# EAGLE design relay interface v2 (EAGLE 7.1.0)
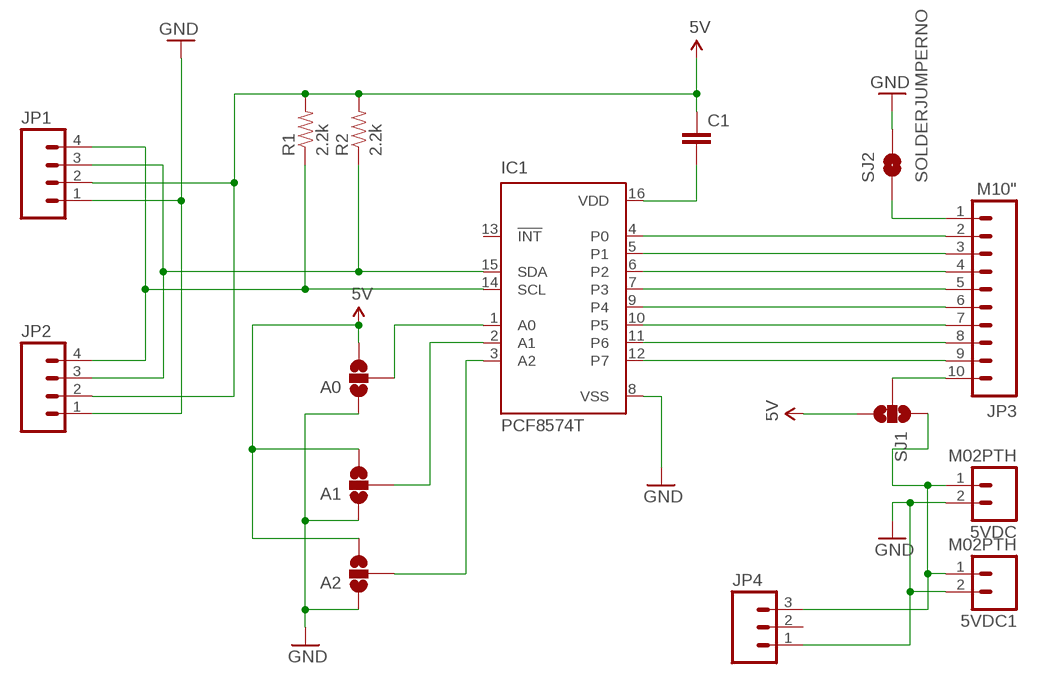
[diagram p0: schematic, sheet 1]

## Parts
5VDC  M02PTH  [1X02]
5VDC1  M02PTH  [1X02]
A0  SOLDERJUMPER_2WAYS  [SJ_3]
A1  SOLDERJUMPER_2WAYS  [SJ_3]
A2  SOLDERJUMPER_2WAYS  [SJ_3]
C1  CAPPTH2  [CAP-PTH-SMALL2]
IC1  PCF8574T  [SO16W]
JP1  M04PTH  [1X04]
JP2  M04PTH  [1X04]
JP3  M10"  [1X10]
JP4  M03PTH  [1X03]
R1  2.2k  RESISTOR1206  [1206]
R2  2.2k  RESISTOR1206  [1206]
SJ1  SOLDERJUMPER_2WAYS  [SJ_3]
SJ2  SOLDERJUMPERNO  [SJ_2S-NO]

## Nets
5V: A0.3 A1.3 A2.3 C1.1 JP1.2 JP2.2 R1.2 R2.2 SJ1.3
GND: 5VDC1.2 5VDC.2 A0.1 A1.1 A2.1 IC1.8(VSS) JP1.1 JP2.1 JP4.1 SJ2.2
N$1: IC1.4(P0) JP3.2
N$2: IC1.5(P1) JP3.3
N$3: IC1.6(P2) JP3.4
N$4: A0.2 IC1.1(A0)
N$5: IC1.14(SCL) JP1.4 JP2.4 R1.1
N$6: IC1.15(SDA) JP1.3 JP2.3 R2.1
N$7: A1.2 IC1.2(A1)
N$8: C1.2 IC1.16(VDD)
N$9: A2.2 IC1.3(A2)
N$10: IC1.7(P3) JP3.5
N$11: IC1.9(P4) JP3.6
N$12: IC1.10(P5) JP3.7
N$13: IC1.11(P6) JP3.8
N$14: IC1.12(P7) JP3.9
N$15: 5VDC1.1 5VDC.1 JP4.3 SJ1.1
N$16: JP3.1 SJ2.1
N$17: JP3.10 SJ1.2
Unconnected: IC1.13(!INT) JP4.2

## Library data of the parts
5VDC 5VDC1 = SparkFun-Connectors:M02: Standard 2-pin 0.1" header. Use with - straight break away headers ( PRT-00116) - right angle break away headers (PRT-00553) - swiss pins (PRT-00743) - machine pins (PRT-00117) - female headers (PRT-00115) Molex polarized connector foot print use with: PRT-08233 with associated crimp pins and housings. 2.54_SCREWTERM for use with PRT-10571. 3.5mm Screw Terminal footprints for PRT-08084 5mm Screw Terminal footprints for use with PRT-08432
A0 A1 A2 SJ1 = SparkFun-Retired:SOLDERJUMPER_2WAY: Solder Jumper 2 way solder jumper
C1 = SparkFun-Capacitors:CAP: Capacitor Standard 0603 ceramic capacitor, and 0.1" leaded capacitor.
IC1 = micro-philips:PCF8574: I2C-Bus Remote 8-bit I/O expander http://www.semiconductors.philips.com/acrobat_download/datasheets/PCF8574_4.pdf
JP1 JP2 = SparkFun-Connectors:M04: Header 4 Standard 4-pin 0.1" header. Use with straight break away headers (SKU : PRT-00116), right angle break away headers (PRT-00553), swiss pins (PRT-00743), machine pins (PRT-00117), and female headers (PRT-00115). Molex polarized connector foot print use with SKU : PRT-08231 with associated crimp pins and housings. 1MM SMD Version SKU: PRT-10208
JP3 = SparkFun-Connectors:M10: Header 10 Standard 10-pin 0.1" header. Use with straight break away headers (SKU : PRT-00116), right angle break away headers (PRT-00553), swiss pins (PRT-00743), machine pins (PRT-00117), and female headers (PRT-00115).
JP4 = SparkFun-Connectors:M03: Header 3 Standard 3-pin 0.1" header. Use with straight break away headers (SKU : PRT-00116), right angle break away headers (PRT-00553), swiss pins (PRT-00743), machine pins (PRT-00117), and female headers (PRT-00115). Molex polarized connector foot print use with SKU : PRT-08232 with associated crimp pins and housings.
R1 R2 = SparkFun-Resistors:RESISTOR: Resistor Basic schematic elements and footprints for 0603, 1206, and PTH resistors.
SJ2 = SparkFun-Retired:SOLDERJUMPER: Solder Jumper Standard SMD solder jumper. Used to automate production. Two varients : Normally Open and Normally Closed are the same, but have different paste layers. NC will have a large amount of paste and should jumper during reflow.

## Board
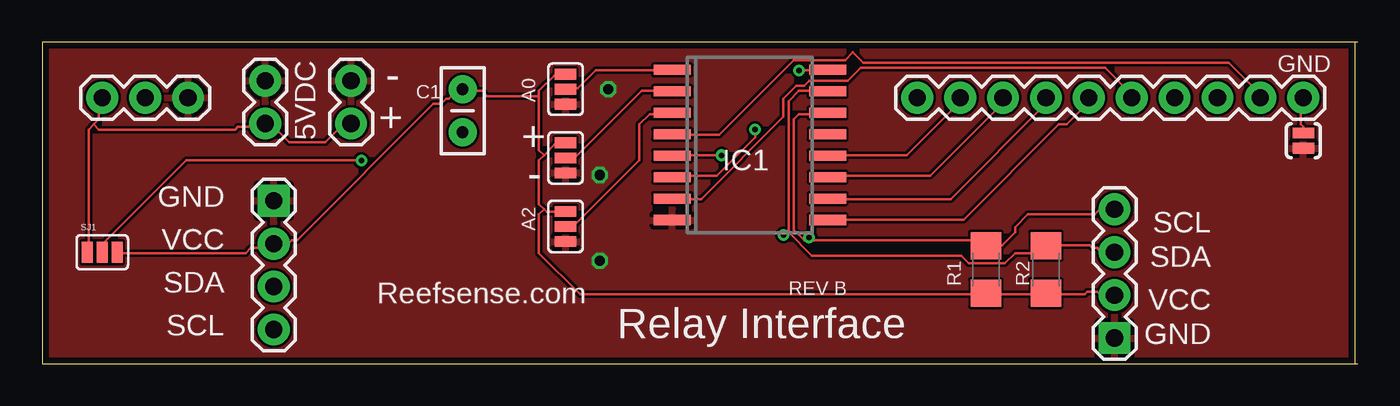
[diagram p1: board, top side]
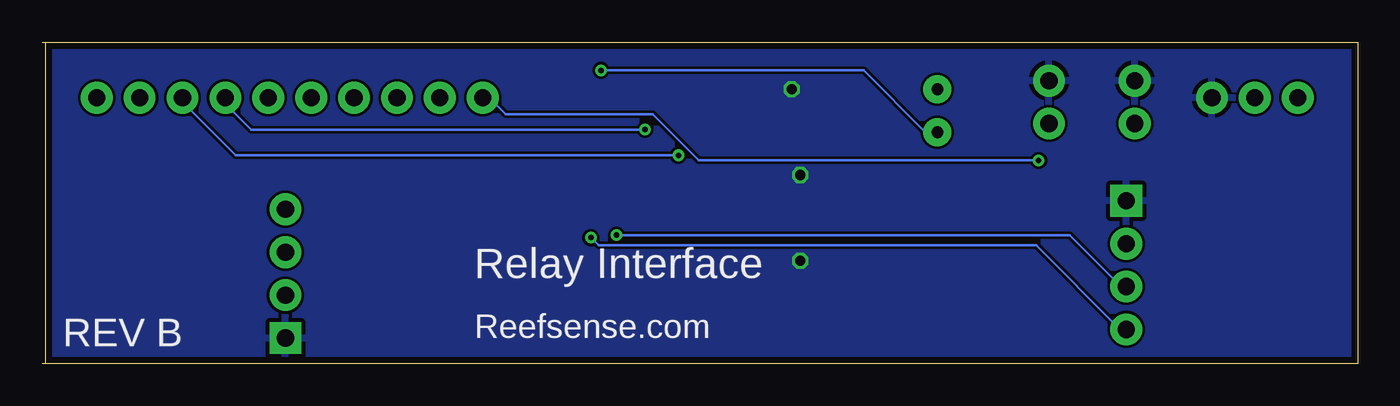
[diagram p2: board, bottom side, seen from below]

Size 77.9 x 19.04 mm. Coordinates in mm from the lower left corner, seen from the top.
Outline: 77.72,0 0,0 0,19.04 77.72,19.04
Outline: 77.72,0 77.9,0
Outline: 77.9,19.04 77.72,19.04
Outline: 77.72,19.04 77.72,0
Copper layers (1*16): Top 0.0356mm / dielectric 1.5011mm / Bottom 0.0356mm
Design rules "LaenPCBOrder": minimum track width 6mil, minimum drill 13mil, track to track 6mil, track to pad 6mil, pad to pad 6mil, via to via 6mil, smd to smd 6mil, copper to edge 15mil, drill to drill 6mil, minimum pad ring 7mil, minimum via ring 7mil, stop-mask expansion 3mil, vias tented up to drill 0mil, thermal gap 10mil

### Footprints (pad centres in the part's own frame; a part is rotated, then mirrored left to right if it is on the bottom)
1X02 = drill 1.016 pad 1.88: 1 0,0; 2 2.54,0
SJ_3 = smd 0.635 x 1.27: 1 -0.889,0; 2 0,0; 3 0.889,0
CAP-PTH-SMALL2 = drill 0.7 pad 1.651: 1 0,0; 2 2.54,0
SO16W = smd 0.6 x 2.2: 1 -4.445,-4.6; 2 -3.175,-4.6; 3 -1.905,-4.6; 4 -0.635,-4.6; 5 0.635,-4.6; 6 1.905,-4.6; 7 3.175,-4.6; 8 4.445,-4.6; 9 4.445,4.6; 10 3.175,4.6; 11 1.905,4.6; 12 0.635,4.6; 13 -0.635,4.6; 14 -1.905,4.6; 15 -3.175,4.6; 16 -4.445,4.6
1X04 = drill 1.016 pad 1.88 square: 1 0,0 | drill 1.016 pad 1.88: 2 2.54,0; 3 5.08,0; 4 7.62,0
1X10 = drill 1.016 pad 1.88: 1 0,0; 2 2.54,0; 3 5.08,0; 4 7.62,0; 5 10.16,0; 6 12.7,0; 7 15.24,0; 8 17.78,0; 9 20.32,0; 10 22.86,0
1X03 = drill 1.016 pad 1.88: 1 0,0; 2 2.54,0; 3 5.08,0
1206 = smd 1.6 x 1.8: 1 -1.4,0; 2 1.4,0
SJ_2S-NO = smd 0.635 x 1.27: 1 -0.45,0; 2 0.45,0

### Placement (x,y rotation side)
5VDC  13.21,14.22 90 top
5VDC1  18.29,14.22 90 top
A0  30.99,16.26 90 top
A1  30.99,12.19 90 top
A2  30.99,8.13 90 top
C1  24.89,16.26 270 top
IC1  41.91,12.95 270 top
JP1  13.72,9.65 270 top
JP2  63.5,1.52 90 top
JP3  74.68,15.75 180 top
JP4  8.64,15.75 180 top
R1  55.88,5.59 270 top
R2  59.44,5.59 270 top
SJ1  3.56,6.6 0 top
SJ2  74.68,13.21 270 top

### Tracks (layer width: path | path; a pad name or v marks a point on that pad's centre or on a via)
5V
  Top 0.152: SJ1.3 4.57,6.55 12.04,6.55 12.34,6.86 13.56,6.86 13.72,7.01 JP1.2 13.72,7.16 14.63,7.16 14.78,7.32 15.09,7.32 23.16,15.39 23.62,15.39 23.93,15.7 24.08,15.7 24.54,16.15 24.84,16.15 C1.1 24.99,16.15 26.06,16.15 26.36,15.85 29.41,15.85 | 59.44,4.12 55.93,4.12 R1.2 55.78,4.12 31.85,4.12 29.41,6.55 29.41,8.84 29.72,9.14 | 59.44,4.12 61.72,4.12 61.87,4.27 62.48,4.27 62.64,4.12 63.4,4.12 JP2.2 | 59.44,4.12 R2.2 | 29.72,9.14 29.41,9.45 29.41,12.04 29.72,12.34 | 29.72,9.14 29.87,8.99 30.94,8.99 A2.3 | 29.72,12.34 30.33,12.95 30.94,12.95 A1.3 | 29.41,15.85 29.41,12.65 29.72,12.34 | 29.41,15.85 29.41,16.15 30.33,17.07 30.94,17.07 A0.3
GND  (via drill 0.6)
  other vias: 33.02,11.18 33.53,16.26 33.02,6.1
  pour Top: -14.22,23.37 80.26,21.34 80.26,-3.56 -13.72,-2.54
  pour Bottom: -13.72,-2.54 80.77,-4.06 80.26,22.35 -14.22,23.88
N$1
  Top 0.152: IC1.4 37.34,13.56 40.08,13.56 44.5,17.98 47.55,17.98 48.01,18.44 48.62,17.83 70.26,17.83 72.24,15.85 JP3.2
N$2  (via drill 0.33)
  Top 0.152: v40.23,12.34 37.34,12.34 IC1.5
  Bottom 0.152: v40.23,12.34 66.45,12.34 69.49,15.39 69.49,15.7 JP3.3
N$3  (via drill 0.33)
  Top 0.152: v42.22,13.87 42.22,13.41 39.93,11.12 37.34,11.12 IC1.6
  Bottom 0.152: v42.22,13.87 65.53,13.87 67.06,15.39 JP3.4
N$4
  Top 0.152: A0.2 31.09,16.31 31.7,16.31 32.77,17.37 37.19,17.37 IC1.1
N$5  (via drill 0.33)
  Top 0.152: JP2.4 62.64,9.14 62.33,8.84 58.37,8.84 57.61,8.08 57.61,7.77 56.84,7.01 55.93,7.01 R1.1 55.78,7.01 55.47,7.32 45.41,7.32 | 45.41,7.32 45.11,7.32 44.5,7.92 44.5,14.48 44.81,14.78 46.48,14.78 IC1.14 | 45.41,7.32 v45.41,7.47
  Bottom 0.152: v45.41,7.47 44.96,7.01 19.05,7.01 14.17,2.13 13.72,2.13 JP1.4
N$6  (via drill 0.33)
  Top 0.152: JP2.3 63.4,6.71 62.64,6.71 62.48,6.86 62.18,6.86 62.03,7.01 59.44,7.01 R2.1 59.44,6.86 59.13,6.55 57.61,6.55 57,5.94 54.86,5.94 54.41,6.4 45.57,6.4 44.2,7.77 44.2,7.92 | 44.2,7.92 44.2,15.54 44.81,16.15 46.48,16.15 IC1.15 | 44.2,7.92 v43.89,7.62
  Bottom 0.152: JP1.3 14.02,4.57 17.07,7.62 v43.89,7.62
N$7
  Top 0.152: A1.2 31.55,12.19 35.51,16.15 37.19,16.15 IC1.2
N$8  (via drill 0.33)
  Top 0.152: v44.81,17.37 46.48,17.37 IC1.16
  Bottom 0.152: v44.81,17.37 29.26,17.37 25.6,13.72 C1.2
N$9
  Top 0.152: A2.2 31.09,8.23 31.55,8.23 35.36,12.04 35.36,14.17 35.97,14.78 37.19,14.78 IC1.3
N$10
  Top 0.152: IC1.7 37.34,9.75 39.01,9.75 43.89,14.63 43.89,15.7 44.65,16.46 45.11,16.46 45.41,16.76 47.7,16.76 48.46,17.53 62.94,17.53 64.62,15.85 JP3.5
N$11
  Top 0.152: IC1.9 46.63,8.53 54.56,8.53 60.2,14.17 60.66,14.17 61.87,15.39 61.87,15.7 JP3.6
N$12
  Top 0.152: JP3.7 59.44,15.39 53.8,9.75 46.63,9.75 IC1.10
N$13
  Top 0.152: IC1.11 46.63,11.12 52.58,11.12 56.84,15.39 56.84,15.7 JP3.8
N$14
  Top 0.152: IC1.12 46.63,12.34 51.21,12.34 54.25,15.39 54.25,15.7 JP3.9
N$15
  Top 0.152: 5VDC1.1 18.29,14.17 17.83,14.17 16.76,13.11 14.63,13.11 13.56,14.17 13.26,14.17 5VDC.1 13.11,14.17 12.34,14.17 12.19,14.02 11.58,14.02 11.43,13.87 3.35,13.87 3.05,14.17 | 3.05,14.17 3.35,14.48 3.35,15.54 JP4.3 | 3.05,14.17 2.74,13.87 2.74,6.71 SJ1.1
N$16
  Top 0.152: SJ2.1 74.68,14.02 74.52,14.17 74.52,15.54 74.68,15.7 JP3.1
N$17  (via drill 0.33)
  Top 0.152: v18.9,12.04 8.53,12.04 3.66,7.16 3.66,6.71 SJ1.2
  Bottom 0.152: v18.9,12.04 39.01,12.04 41.76,14.78 50.44,14.78 51.36,15.7 51.82,15.7 JP3.10

### Text on the board
tNames: GND | - | + | + | - | GND | SCL | VCC | SDA | SDA | Reefsense.com | REV B | VCC | SCL | Relay Interface | GND
bNames: Relay Interface | Reefsense.com | REV B